# Altium project Power Sense Module.PrjPcb
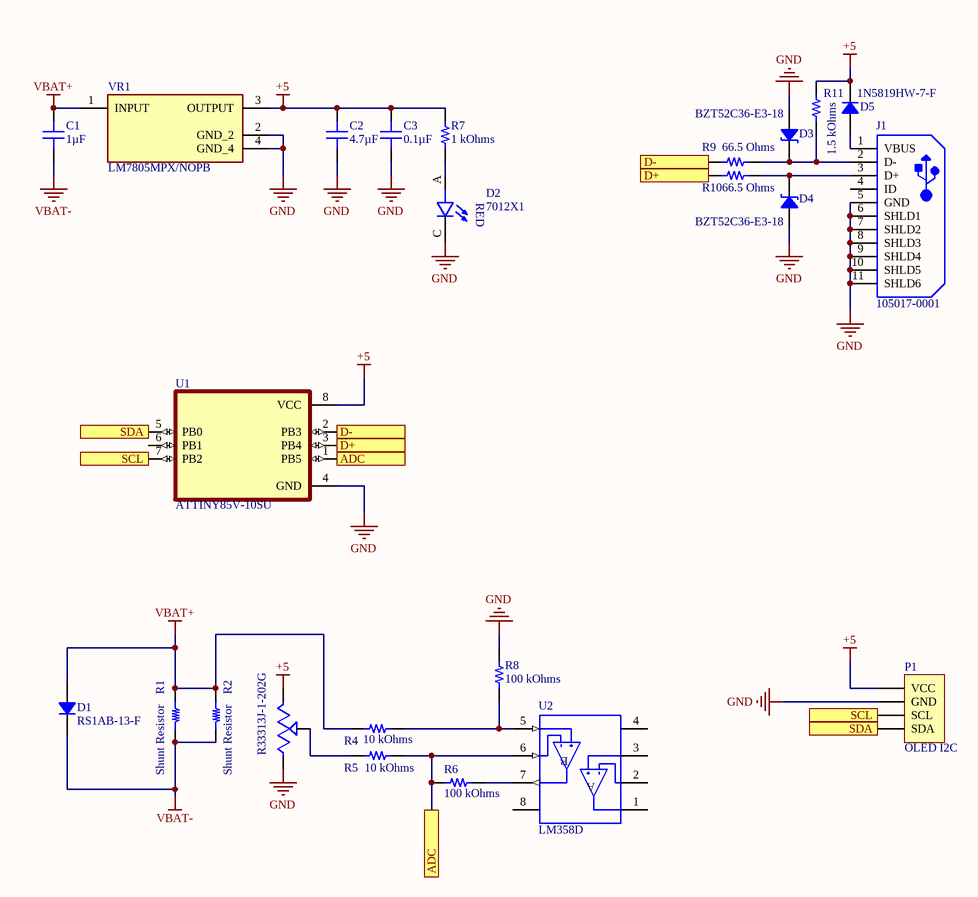
[diagram p0: Power Sense Module SCH.SchDoc]
1 sheet, 24 parts. Net scope: flat (ports and power ports of the same name join across sheets).
Board file: Power Sense Module PCB.PcbDoc

## Sheet Power Sense Module SCH.SchDoc
size A4; SheetNumber: 1; SheetTotal: 1

### Parts
C1  1µF  [CAP 1206_3216 - 0.8MM]
C2  4.7µF  [CAP 1206_3216 - 1.0MM]
C3  0.1µF  [CAP 1206_3216 - 0.8MM]
D1  RS1AB-13-F  [DO214AA SMB]
D2  7012X1  [LED_7012X1]
D3  BZT52C36-E3-18  [SOD-123]
D4  BZT52C36-E3-18  [SOD-123]
D5  1N5819HW-7-F  [SOD-123]
J1  105017-0001  [USB-MICRO-B_V]
P1  OLED I2C  [OLED I2C]
R1  Shunt Resistor  [RESC6430X04N]
R2  Shunt Resistor  [RESC6430X04N]
R3  3313J-1-202G  [TRIM_3313J-1-202G]
R4  10 kOhms  [RES 1206_3216]
R5  10 kOhms  [RES 1206_3216]
R6  100 kOhms  [RES 1206_3216]
R7  1 kOhms  [RES 1206_3216]
R8  100 kOhms  [RES 1206_3216]
R9  66.5 Ohms  [RES 1206_3216]
R10  66.5 Ohms  [RES 1206_3216]
R11  1.5 kOhms  [RES 1206_3216]
U1  ATTINY85V-10SU  [SOIC127P798X216-8N]
U2  LM358D  [SOIC127P599X175-8N]
VR1  LM7805MPX/NOPB  [VREG_LM7805MPX/NOPB]

### Ports
ADC, D+, D-, SCL, SDA

### Nets
+5: C2.2 C3.2 D5.2 P1.1(VCC) R3.3(CW) R7.2 R11.2 U1.8(VCC) VR1.3(OUTPUT)
GND: C2.1 C3.1 D2.C D3.1 D4.1 J1.5(GND) J1.6(SHLD1) J1.7(SHLD2) J1.8(SHLD3) J1.9(SHLD4) J1.10(SHLD5) J1.11(SHLD6) P1.2(GND) R3.1(CCW) R8.2 U1.4(GND) VR1.2(GND_2) VR1.4(GND_4)
VBAT+: C1.2 D1.1 R1.2 R2.2 R4.2 VR1.1(INPUT)
VBAT-: C1.1 D1.2 R1.1 R2.1
NetD2_A: D2.A R7.1
NetD3_2: D3.2 J1.2(D-) R9.2 R11.1
NetD4_2: D4.2 J1.3(D+) R10.2
NetD5_1: D5.1 J1.1(VBUS)
NetP1_3: P1.3(SCL) U1.7(PB2) ; port SCL
NetP1_4: P1.4(SDA) U1.5(PB0) ; port SDA
NetR3_2: R3.2(WIPER) R5.1
NetR4_1: R4.1 R8.1 U2.5(IN2+)
NetR5_2: R5.2 R6.2 U1.1(PB5) U2.6(IN2-) ; port ADC
NetR6_1: R6.1 U2.7(OUT2)
NetR9_1: R9.1 U1.2(PB3) ; port D-
NetR10_1: R10.1 U1.3(PB4) ; port D+

Not connected (* = marked no-connect by the designer): J1 4(ID); U1 6(PB1); U2 1(OUT1) 2(IN1-) 3(IN1+) 4(V-) 8(V+)

### Notes on the sheet
- (in symbol 7012X1) RED
- (in symbol LM358D) B; A

### Library data of the parts
C1 = AC1206KKX7R8BB105: CAP CER 1UF 25V X7R 1206; Manufacturer: Yageo; Tolerance: ±10%; Part Number: AC1206KKX7R8BB105; Value: 1µF; Applications: Automotive; Capacitance: 1µF; ComponentLink1Description: Datasheet; ComponentLink1URL: http://www.yageo.com/documents/recent/UPY-AC_NP0X7R_16V-to-630V_12.pdf; ComponentLink2Description: DigiKey Link; ComponentLink2URL: http://digikey.com/product-detail/en/yageo/AC1206KKX7R8BB105/311-3039-1-ND/6643290; Device Package: 1206 (3216 Metric); LastUpdated: 2.09.2020 01:04:45; Lifecycle Status: Active; Minimum Order: 1; Mounting Type: Surface Mount, MLCC; Operating Temperature: -55°C ~ 125°C; Package / Case: 1206 (3216 Metric); Packaging: TapeAndReel; PartId: 18820; Part Status: Active; Price: 0.22; Ratings: AEC-Q200; Series: AC; Size / Dimension: 0.126" L x 0.063" W (3.20mm x 1.60mm); Supplier 1: DigiKey; Supplier Part Number 1: 311-3039-1-ND; Temperature Coefficient: X7R; Thickness (Max): 0.028" (0.70mm); Voltage - Rated: 25V
C2 = UMK316ABJ475KD-T: CAP CER 4.7UF 50V X5R 1206; Manufacturer: Taiyo Yuden; Tolerance: ±10%; Part Number: UMK316ABJ475KD-T; Value: 4.7µF; Applications: General Purpose; Capacitance: 4.7µF; ComponentLink1Description: Datasheet; ComponentLink1URL: https://www.yuden.co.jp/productdata/catalog/mlcc01_e.pdf; ComponentLink2Description: DigiKey Link; ComponentLink2URL: http://digikey.com/product-detail/en/taiyo-yuden/UMK316ABJ475KD-T/587-2988-1-ND/2714181; Device Package: 1206 (3216 Metric); LastUpdated: 2.09.2020 01:05:06; Lifecycle Status: Active; Minimum Order: 1; Mounting Type: Surface Mount, MLCC; Operating Temperature: -55°C ~ 85°C; Package / Case: 1206 (3216 Metric); Packaging: TapeAndReel; PartId: 18934; Part Status: Active; Price: 0.12; Series: M; Size / Dimension: 0.126" L x 0.063" W (3.20mm x 1.60mm); Supplier 1: DigiKey; Supplier Part Number 1: 587-2988-1-ND; Temperature Coefficient: X5R; Thickness (Max): 0.037" (0.95mm); Voltage - Rated: 50V
C3 = CC1206MRY5V9BB104: CAP CER 0.1UF 50V Y5V 1206; Manufacturer: Yageo; Temperature Coefficient: Y5V (F); Tolerance: ±20%; Part Number: CC1206MRY5V9BB104; Value: 0.1µF; Applications: General Purpose; Capacitance: 0.1µF; ComponentLink1Description: Datasheet; ComponentLink1URL: http://www.yageo.com/documents/recent/UPY-GPHC_Y5V_6.3V-to-50V_8.pdf; ComponentLink2Description: DigiKey Link; ComponentLink2URL: http://digikey.com/product-detail/en/yageo/CC1206MRY5V9BB104/311-4504-1-ND/8025593; Device Package: 1206 (3216 Metric); LastUpdated: 2.09.2020 01:04:46; Lifecycle Status: Active; Minimum Order: 1; Mounting Type: Surface Mount, MLCC; Operating Temperature: -30°C ~ 85°C; Package / Case: 1206 (3216 Metric); Packaging: TapeAndReel; PartId: 18711; Part Status: Active; Price: 0.06; Series: CC; Size / Dimension: 0.126" L x 0.063" W (3.20mm x 1.60mm); Supplier 1: DigiKey; Supplier Part Number 1: 311-4504-1-ND; Thickness (Max): 0.028" (0.70mm); Voltage - Rated: 50V
D1 = RS1AB-13-F: DIODE GEN PURP 50V 1A SMB; Manufacturer: Diodes Incorporated; Capacitance @ Vr, F: 15pF @ 4V, 1MHz; Current - Reverse Leakage @ Vr: 5µA @ 50V; Diode Type: Standard; Reverse Recovery Time (trr): 150ns; Speed: Fast Recovery =< 500ns, > 200mA (Io); Voltage - Forward (Vf) (Max) @ If: 1.3V @ 1A; Part Number: RS1AB-13-F; ComponentLink1Description: Datasheet; ComponentLink1URL: https://www.diodes.com/assets/Datasheets/ds15002.pdf; ComponentLink2Description: DigiKey Link; ComponentLink2URL: http://digikey.com/product-detail/en/diodes-incorporated/RS1AB-13-F/RS1AB-FDICT-ND/815907; Current - Average Rectified (Io): 1A; LastUpdated: 2.09.2020 01:18:53; Lifecycle Status: Active; Minimum Order: 1; Mounting Type: Surface Mount; Operating Temperature - Junction: -65°C ~ 150°C; Package / Case: DO-214AA, SMB; Packaging: TapeAndReel; PartId: 27; Part Status: Active; Price: 0.09; Series: -; Supplier 1: DigiKey; Supplier Part Number 1: RS1AB-FDICT-ND; Supplier Device Package: SMB; Voltage - DC Reverse (Vr) (Max): 50V
D2 = 7012X1: Red LED Indication - Discrete 1.7V 0805 (2012 Metric); Package: None; Price: None; Value: *; MP: 7012X1; Availability: Unavailable
D3 D4 = BZT52C36-E3-18: DIODE ZENER 36V 410MW SOD123; Manufacturer: Vishay Semiconductor Diodes Division; Current - Reverse Leakage @ Vr: 100nA @ 27V; Impedance (Max) (Zzt): 40 Ohms; Tolerance: ±5%; Part Number: BZT52C36-E3-18; ComponentLink1Description: Datasheet; ComponentLink1URL: http://www.vishay.com/docs/85760/bzt52.pdf; ComponentLink2Description: DigiKey Link; ComponentLink2URL: http://digikey.com/product-detail/en/vishay-semiconductor-diodes-division/BZT52C36-E3-18/BZT52C36-E3-18GICT-ND/9600530; LastUpdated: 2.09.2020 01:19:26; Lifecycle Status: Active; Minimum Order: 1; Mounting Type: Surface Mount; Operating Temperature: -55°C ~ 150°C; Package / Case: SOD-123; Packaging: TapeAndReel; PartId: 1960; Part Status: Active; Power - Max: 410mW; Price: 0.03; Series: -; Supplier 1: DigiKey; Supplier Part Number 1: BZT52C36-E3-18GICT-ND; Supplier Device Package: SOD-123; Voltage - Zener (Nom) (Vz): 36V
D5 = 1N5819HW-7-F: DIODE SCHOTTKY 40V 1A SOD123; Manufacturer: Diodes Incorporated; Capacitance @ Vr, F: 60pF @ 4V, 1MHz; Current - Reverse Leakage @ Vr: 1mA @ 40V; Speed: Fast Recovery =< 500ns, > 200mA (Io); Voltage - Forward (Vf) (Max) @ If: 450mV @ 1A; Part Number: 1N5819HW-7-F; ComponentLink1Description: Datasheet; ComponentLink1URL: https://www.diodes.com/assets/Datasheets/ds30217.pdf; ComponentLink2Description: DigiKey Link; ComponentLink2URL: http://digikey.com/product-detail/en/diodes-incorporated/1N5819HW-7-F/1N5819HW-FDICT-ND/815283; Current - Average Rectified (Io): 1A; Diode Type: Schottky; LastUpdated: 2.09.2020 01:19:08; Lifecycle Status: Active; Minimum Order: 1; Mounting Type: Surface Mount; Operating Temperature - Junction: -65°C ~ 125°C; Package / Case: SOD-123; Packaging: TapeAndReel; PartId: 2212; Part Status: Active; Price: 0.08; Series: -; Supplier 1: DigiKey; Supplier Part Number 1: 1N5819HW-FDICT-ND; Supplier Device Package: SOD-123; Voltage - DC Reverse (Vr) (Max): 40V
J1 = CMP-2000-05827-1: Micro-USB B Receptacle, Right Angle, Bottom Mount, Surface Mount, with Solder Tabs, -30 to 85 degC, 5-Pin USB, RoHS, Tape and Reel; Manufacturer: Molex; Featured Product: Micro-USBConnectorsUSBConnectors; Other Names: WM1399DKR; Package Version: Rev. F, 12/2012; Number of Contacts: 5; Connector Type: USB-microB; Catalog Drawings: 1050170001; 3D Model: 105017-0001.stp; Mating Products: WM17145-ND-CABLEMICROUSBBTOSTDA1.0MWM17147-ND-CABLEMICROUSBBTOSTDA2.0MWM17146-ND-CABLEMICROUSBBTOSTDA1.5M; PCN Assembly/Origin: ResinSupplier21/Oct/2015; Voltage - Max: 30V; Online Catalog: Molex-MicroUSB; Manufacturer URL: http://www.molex.com/; Package Description: 5-Leads USB, Micro B, Body 7.5 x 5 mm, Pitch 0.65 mm; Datasheet URL: http://www.molex.com/elqNow/elqRedir.htm?ref=http://www.molex.com/webdocs/datasheets/pdf/en-us/1050170001_IO_CONNECTORS.pdf; Ingress Protection: -; Datasheet Version: 03/2016; Mounting Type: BoardCutout,SurfaceMount,RightAngle; Circuits: 5; Standard Package: 1; Package Reference: MICRO-B; Package URL: http://www.molex.com/pdm_docs/sd/1050170001_sd.pdf; Category: Connectors,Interconnects; Series: -; RoHS Information: 1050170001CertofCompliance; Features: Shielded,SolderRetention; Family: USB,DVI,HDMIConnectors; Specifications: -; Gender: Receptacle; Packaging: Digi-Reel®; Mounting Technology: SurfaceMount
R3 = 3313J-1-202G: Trimpot 2.0k Ohm 3mm Sq Cer St; MF: Bourns; Availability: Unavailable; SnapEDA_Link: https://www.snapeda.com/parts/3313J-1-202G/Bourns/view-part/1480845/?ref=snap; Package: None; MP: 3313J-1-202G; Value: *; Price: None
R4 R5 = CR1206AFX-1002EAS: RESA-AS 1206 10K 1% 250MW TC100; Manufacturer: Bourns Inc.; Power (Watts): 0.25W, 1/4W; Temperature Coefficient: ±100ppm/°C; Part Number: CR1206AFX-1002EAS; ComponentLink1Description: Datasheet; ComponentLink1URL: //media.digikey.com/pdf/Data%20Sheets/Bourns%20PDFs/CRyyyyA-AS_Model_DS.pdf; ComponentLink2Description: DigiKey Link; ComponentLink2URL: http://digikey.com/product-detail/en/bourns-inc/CR1206AFX-1002EAS/CR1206AFX-1002EASCT-ND/10240189; Composition: Thick Film; Device Package: 1206 (3216 Metric); Features: Anti-Sulfur, Automotive AEC-Q200, Moisture Resistant; Height - Seated (Max): 0.026" (0.65mm); LastUpdated: 2.09.2020 01:13:10; Lifecycle Status: Active; Minimum Order: 1; Number of Terminations: 2; Operating Temperature: -55°C ~ 155°C; Package / Case: 1206 (3216 Metric); Packaging: TapeAndReel; PartId: 26960; Part Status: Active; Price: 0.01; Ratings: AEC-Q200; Resistance: 10 kOhms; Series: CR1206A-AS; Size / Dimension: 0.122" L x 0.061" W (3.10mm x 1.55mm); Supplier 1: DigiKey; Supplier Part Number 1: CR1206AFX-1002EASCT-ND; Supplier Device Package: 1206; Tolerance: ±1%; Value: 10 kOhms
R6 R8 = RT1206BRB07100KL: RES SMD 100K OHM 0.1% 1/4W 1206; Manufacturer: Yageo; Power (Watts): 0.25W, 1/4W; Temperature Coefficient: ±10ppm/°C; Part Number: RT1206BRB07100KL; ComponentLink1Description: Datasheet; ComponentLink1URL: https://www.yageo.com/upload/media/product/productsearch/datasheet/rchip/PYu-RT_1-to-0.01_RoHS_L_11.pdf; ComponentLink2Description: DigiKey Link; ComponentLink2URL: http://digikey.com/product-detail/en/yageo/RT1206BRB07100KL/YAG5016CT-ND/6617172; Composition: Thin Film; Device Package: 1206 (3216 Metric); Height - Seated (Max): 0.026" (0.65mm); LastUpdated: 2.09.2020 01:13:11; Lifecycle Status: Active; Minimum Order: 1; Number of Terminations: 2; Operating Temperature: -55°C ~ 155°C; Package / Case: 1206 (3216 Metric); Packaging: TapeAndReel; PartId: 26928; Part Status: Active; Price: 0.22; Resistance: 100 kOhms; Series: RT; Size / Dimension: 0.122" L x 0.063" W (3.10mm x 1.60mm); Supplier 1: DigiKey; Supplier Part Number 1: YAG5016CT-ND; Supplier Device Package: 1206; Tolerance: ±0.1%; Value: 100 kOhms
R7 = RNCS1206BKE1K00: RES 1K OHM 0.1% 1/8W 1206; Manufacturer: Stackpole Electronics Inc; Power (Watts): 0.125W, 1/8W; Temperature Coefficient: ±25ppm/°C; Part Number: RNCS1206BKE1K00; ComponentLink1Description: Datasheet; ComponentLink1URL: https://www.seielect.com/catalog/sei-rncs_rnch.pdf; ComponentLink2Description: DigiKey Link; ComponentLink2URL: http://digikey.com/product-detail/en/stackpole-electronics-inc/RNCS1206BKE1K00/RNCS1206BKE1K00CT-ND/1800334; Composition: Thin Film; Device Package: 1206 (3216 Metric); Features: Anti-Corrosive, Automotive AEC-Q200, Moisture Resistant; Height - Seated (Max): 0.026" (0.65mm); LastUpdated: 2.09.2020 01:13:11; Lifecycle Status: Active; Minimum Order: 1; Number of Terminations: 2; Operating Temperature: -55°C ~ 155°C; Package / Case: 1206 (3216 Metric); Packaging: TapeAndReel; PartId: 26856; Part Status: Active; Price: 0.10; Ratings: AEC-Q200; Resistance: 1 kOhms; Series: RNCS; Size / Dimension: 0.120" L x 0.061" W (3.05mm x 1.55mm); Supplier 1: DigiKey; Supplier Part Number 1: RNCS1206BKE1K00CT-ND; Supplier Device Package: 1206; Tolerance: ±0.1%; Value: 1 kOhms
R9 R10 = RK73H2BTTD66R5F: RES 66.5 OHM 1% 1/4W 1206; Manufacturer: KOA Speer Electronics, Inc.; Power (Watts): 0.25W, 1/4W; Temperature Coefficient: ±100ppm/°C; Part Number: RK73H2BTTD66R5F; ComponentLink1Description: Datasheet; ComponentLink1URL: http://www.koaspeer.com/catimages/Products/RK73H/RK73H.pdf; ComponentLink2Description: DigiKey Link; ComponentLink2URL: http://digikey.com/product-detail/en/koa-speer-electronics-inc/RK73H2BTTD66R5F/2019-RK73H2BTTD66R5FCT-ND/10237441; Composition: Thick Film; Device Package: 1206 (3216 Metric); Features: Automotive AEC-Q200, Moisture Resistant; Height - Seated (Max): 0.028" (0.70mm); LastUpdated: 2.09.2020 01:13:09; Lifecycle Status: Active; Minimum Order: 1; Number of Terminations: 2; Operating Temperature: -55°C ~ 155°C; Package / Case: 1206 (3216 Metric); Packaging: TapeAndReel; PartId: 27226; Part Status: Active; Price: 0.01; Ratings: AEC-Q200; Resistance: 66.5 Ohms; Series: RK73H; Size / Dimension: 0.126" L x 0.063" W (3.20mm x 1.60mm); Supplier 1: DigiKey; Supplier Part Number 1: 2019-RK73H2BTTD66R5FCT-ND; Supplier Device Package: 1206; Tolerance: ±1%; Value: 66.5 Ohms
R11 = RNCP1206FTD1K50: RES 1.5K OHM 1% 1/2W 1206; Manufacturer: Stackpole Electronics Inc; Power (Watts): 0.5W, 1/2W; Temperature Coefficient: ±100ppm/°C; Part Number: RNCP1206FTD1K50; ComponentLink1Description: Datasheet; ComponentLink1URL: https://www.seielect.com/catalog/sei-rncp.pdf; ComponentLink2Description: DigiKey Link; ComponentLink2URL: http://digikey.com/product-detail/en/stackpole-electronics-inc/RNCP1206FTD1K50/RNCP1206FTD1K50CT-ND/2240679; Composition: Thin Film; Device Package: 1206 (3216 Metric); Features: Anti-Sulfur, Moisture Resistant; Height - Seated (Max): 0.024" (0.60mm); LastUpdated: 2.09.2020 01:13:10; Lifecycle Status: Active; Minimum Order: 1; Number of Terminations: 2; Operating Temperature: -55°C ~ 155°C; Package / Case: 1206 (3216 Metric); Packaging: TapeAndReel; PartId: 26971; Part Status: Active; Price: 0.01; Resistance: 1.5 kOhms; Series: RNCP; Size / Dimension: 0.122" L x 0.059" W (3.10mm x 1.50mm); Supplier 1: DigiKey; Supplier Part Number 1: RNCP1206FTD1K50CT-ND; Supplier Device Package: 1206; Tolerance: ±1%; Value: 1.5 kOhms
U2 = LM358D: Dual standard operational amplifier 8-SOIC 0 to 70; MF: Texas Instruments; Digi-Key_Part_Number: 296-1014-2-ND; Arrow_Electronics-Purchase-URL: https://snapeda.com/shop?store=Arrow+Electronics&id=4793021; MP: LM358D; Value: *; SnapEDA_Link: https://www.snapeda.com/parts/LM358D/Texas%20Instruments/view-part/4793021/?ref=snap; DigiKey-Purchase-URL: https://snapeda.com/shop?store=DigiKey&id=4793021; Package: SOIC-8 Texas Instruments; Texas_Instruments-Purchase-URL: https://snapeda.com/shop?store=Texas+Instruments&id=4793021; Mouser-Purchase-URL: https://snapeda.com/shop?store=Mouser&id=4793021; Arrow_Asia-Purchase-URL: https://snapeda.com/shop?store=Arrow+Asia&id=4793021
VR1 = LM7805MPX/NOPB: 1.5-A, 30-V, linear voltage regulator 4-SOT-223 0 to 125; MF: Texas Instruments; MP: LM7805MPX/NOPB; Value: *; SnapEDA_Link: https://www.snapeda.com/parts/LM7805MPX/NOPB/Texas%20Instruments/view-part/546225/?ref=snap; Package: SOT-223-4 Texas Instruments; Availability: Good; Mouser-Purchase-URL: https://snapeda.com/shop?store=Mouser&id=546225; Price: None; Texas_Instruments-Purchase-URL: https://snapeda.com/shop?store=Texas+Instruments&id=546225; DigiKey-Purchase-URL: https://snapeda.com/shop?store=DigiKey&id=546225
P1 = OLED I2C: LatestRevisionDate: 17-Jul-2002; LatestRevisionNote: Re-released for DXP Platform.; Publisher: Altium Limited